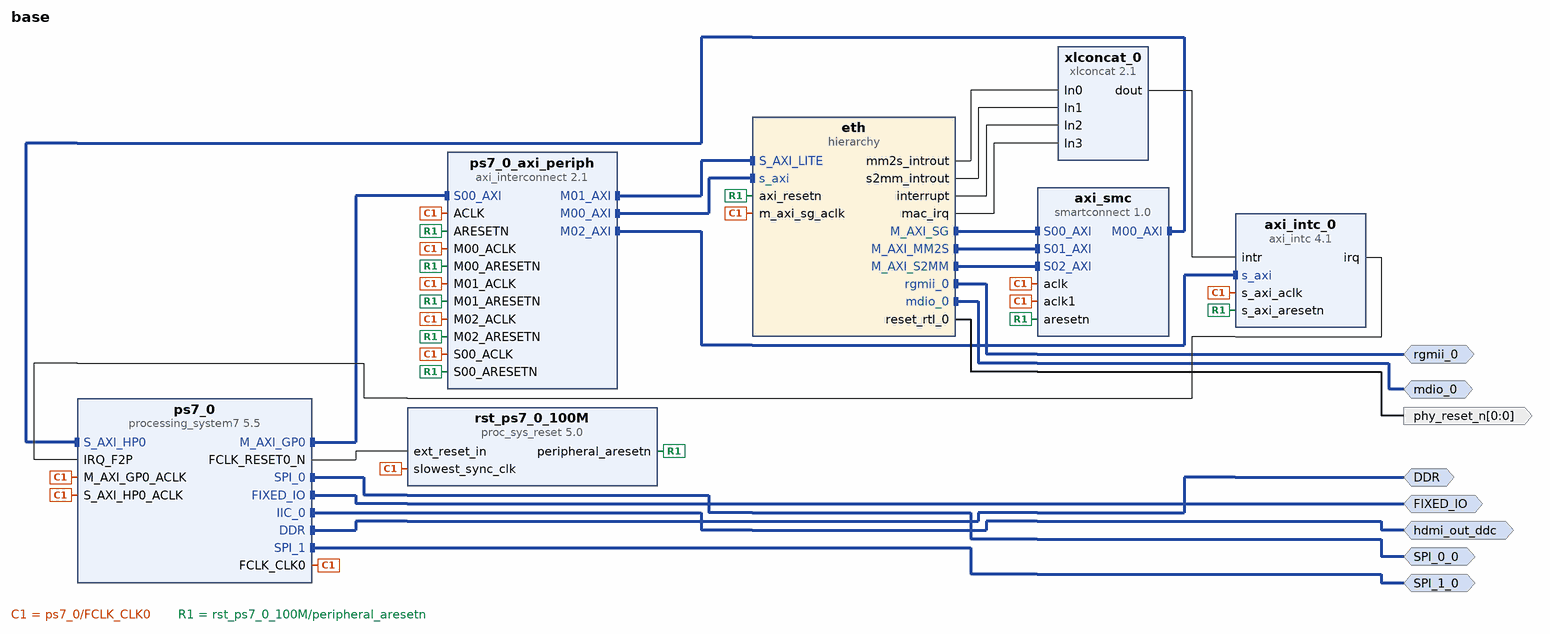
[diagram p0: block diagram of the top level]
# Vivado block design base, xc7z020clg400-1, Vivado 2018.3
create_bd_design base

create_bd_intf_port -mode Master -vlnv xilinx.com:interface:ddrx_rtl:1.0 DDR
create_bd_intf_port -mode Master -vlnv xilinx.com:display_processing_system7:fixedio_rtl:1.0 FIXED_IO
create_bd_intf_port -mode Master -vlnv xilinx.com:interface:iic_rtl:1.0 hdmi_out_ddc
create_bd_intf_port -mode Master -vlnv xilinx.com:interface:mdio_rtl:1.0 mdio_0
create_bd_intf_port -mode Master -vlnv xilinx.com:interface:rgmii_rtl:1.0 rgmii_0
create_bd_intf_port -mode Master -vlnv xilinx.com:interface:spi_rtl:1.0 SPI_0_0
create_bd_intf_port -mode Master -vlnv xilinx.com:interface:spi_rtl:1.0 SPI_1_0
create_bd_port -dir O -from 0 -to 0 -type rst phy_reset_n
set_property -dict {CONFIG.POLARITY ACTIVE_LOW} [get_bd_ports phy_reset_n]

create_bd_cell -type ip -vlnv xilinx.com:ip:processing_system7:5.5 ps7_0
set_property -dict [list \
  CONFIG.PCW_APU_PERIPHERAL_FREQMHZ 650 \
  CONFIG.PCW_CRYSTAL_PERIPHERAL_FREQMHZ 50 \
  CONFIG.PCW_ENET0_ENET0_IO {MIO 16 .. 27} \
  CONFIG.PCW_ENET0_GRP_MDIO_ENABLE 1 \
  CONFIG.PCW_ENET0_GRP_MDIO_IO {MIO 52 .. 53} \
  CONFIG.PCW_ENET0_PERIPHERAL_ENABLE 1 \
  CONFIG.PCW_FPGA0_PERIPHERAL_FREQMHZ 100 \
  CONFIG.PCW_FPGA1_PERIPHERAL_FREQMHZ 142 \
  CONFIG.PCW_FPGA2_PERIPHERAL_FREQMHZ 200 \
  CONFIG.PCW_FPGA3_PERIPHERAL_FREQMHZ 100 \
  CONFIG.PCW_GPIO_EMIO_GPIO_ENABLE 1 \
  CONFIG.PCW_GPIO_EMIO_GPIO_IO 7 \
  CONFIG.PCW_GPIO_EMIO_GPIO_WIDTH 7 \
  CONFIG.PCW_GPIO_MIO_GPIO_ENABLE 0 \
  CONFIG.PCW_I2C0_I2C0_IO EMIO \
  CONFIG.PCW_I2C0_PERIPHERAL_ENABLE 1 \
  CONFIG.PCW_I2C_PERIPHERAL_FREQMHZ 108.333336 \
  CONFIG.PCW_IRQ_F2P_INTR 1 \
  CONFIG.PCW_PERIPHERAL_BOARD_PRESET None \
  CONFIG.PCW_PRESET_BANK1_VOLTAGE {LVCMOS 1.8V} \
  CONFIG.PCW_QSPI_GRP_FBCLK_ENABLE 1 \
  CONFIG.PCW_QSPI_GRP_FBCLK_IO {MIO 8} \
  CONFIG.PCW_QSPI_GRP_SINGLE_SS_ENABLE 1 \
  CONFIG.PCW_QSPI_GRP_SINGLE_SS_IO {MIO 1 .. 6} \
  CONFIG.PCW_QSPI_PERIPHERAL_ENABLE 1 \
  CONFIG.PCW_QSPI_QSPI_IO {MIO 1 .. 6} \
  CONFIG.PCW_SD0_GRP_CD_ENABLE 1 \
  CONFIG.PCW_SD0_GRP_CD_IO {MIO 47} \
  CONFIG.PCW_SD0_GRP_WP_ENABLE 0 \
  CONFIG.PCW_SD0_PERIPHERAL_ENABLE 1 \
  CONFIG.PCW_SD0_SD0_IO {MIO 40 .. 45} \
  CONFIG.PCW_SDIO_PERIPHERAL_FREQMHZ 50 \
  CONFIG.PCW_SINGLE_QSPI_DATA_MODE x4 \
  CONFIG.PCW_SPI0_PERIPHERAL_ENABLE 1 \
  CONFIG.PCW_SPI0_SPI0_IO EMIO \
  CONFIG.PCW_SPI1_PERIPHERAL_ENABLE 1 \
  CONFIG.PCW_SPI1_SPI1_IO EMIO \
  CONFIG.PCW_UART0_PERIPHERAL_ENABLE 1 \
  CONFIG.PCW_UART0_UART0_IO {MIO 14 .. 15} \
  CONFIG.PCW_UART1_PERIPHERAL_ENABLE 0 \
  CONFIG.PCW_UART_PERIPHERAL_FREQMHZ 100 \
  CONFIG.PCW_UIPARAM_DDR_BUS_WIDTH {16 Bit} \
  CONFIG.PCW_UIPARAM_DDR_FREQ_MHZ 525 \
  CONFIG.PCW_UIPARAM_DDR_PARTNO Custom \
  CONFIG.PCW_USB0_PERIPHERAL_ENABLE 1 \
  CONFIG.PCW_USB0_USB0_IO {MIO 28 .. 39} \
  CONFIG.PCW_USE_FABRIC_INTERRUPT 1 \
  CONFIG.PCW_USE_S_AXI_HP0 1 \
] [get_bd_cells ps7_0]
# 484 more settings of ps7_0 are not shown: defaults, MIO pin electricals, DDR timing, and values the tool derives
create_bd_cell -type ip -vlnv xilinx.com:ip:smartconnect:1.0 axi_smc
set_property -dict {CONFIG.NUM_CLKS 2 CONFIG.NUM_SI 3} [get_bd_cells axi_smc]
create_bd_cell -type ip -vlnv xilinx.com:ip:proc_sys_reset:5.0 rst_ps7_0_100M
create_bd_cell -type ip -vlnv xilinx.com:ip:axi_interconnect:2.1 ps7_0_axi_periph
set_property -dict {CONFIG.NUM_MI 3} [get_bd_cells ps7_0_axi_periph]
create_bd_cell -type ip -vlnv xilinx.com:ip:axi_intc:4.1 axi_intc_0
set_property -dict {CONFIG.C_IRQ_CONNECTION 1} [get_bd_cells axi_intc_0]
create_bd_cell -type ip -vlnv xilinx.com:ip:xlconcat:2.1 xlconcat_0
set_property -dict {CONFIG.NUM_PORTS 4} [get_bd_cells xlconcat_0]
create_bd_cell -type hier eth

# ---- hierarchy /eth ----
current_bd_instance /eth
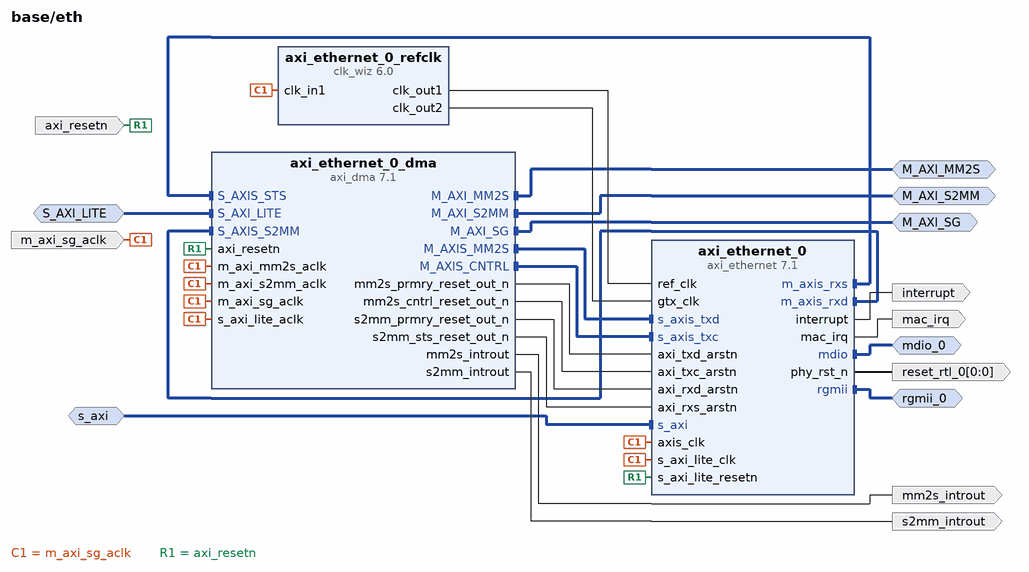
[diagram p1: block diagram inside /eth]
create_bd_intf_pin -mode Slave -vlnv xilinx.com:interface:aximm_rtl:1.0 s_axi
create_bd_intf_pin -mode Master -vlnv xilinx.com:interface:mdio_rtl:1.0 mdio_0
create_bd_intf_pin -mode Master -vlnv xilinx.com:interface:rgmii_rtl:1.0 rgmii_0
create_bd_intf_pin -mode Slave -vlnv xilinx.com:interface:aximm_rtl:1.0 S_AXI_LITE
create_bd_intf_pin -mode Master -vlnv xilinx.com:interface:aximm_rtl:1.0 M_AXI_SG
create_bd_intf_pin -mode Master -vlnv xilinx.com:interface:aximm_rtl:1.0 M_AXI_MM2S
create_bd_intf_pin -mode Master -vlnv xilinx.com:interface:aximm_rtl:1.0 M_AXI_S2MM
create_bd_pin -dir I -type clk m_axi_sg_aclk
create_bd_pin -dir I -type rst axi_resetn
create_bd_pin -dir O -type intr interrupt
create_bd_pin -dir O -from 0 -to 0 -type rst reset_rtl_0
create_bd_pin -dir O -type intr mm2s_introut
create_bd_pin -dir O -type intr s2mm_introut
create_bd_pin -dir O -type intr mac_irq

create_bd_cell -type ip -vlnv xilinx.com:ip:clk_wiz:6.0 axi_ethernet_0_refclk
set_property -dict [list \
  CONFIG.CLKOUT1_REQUESTED_OUT_FREQ 200 \
  CONFIG.CLKOUT2_REQUESTED_OUT_FREQ 125 \
  CONFIG.CLKOUT2_USED true \
  CONFIG.PRIM_SOURCE Single_ended_clock_capable_pin \
  CONFIG.USE_RESET false \
] [get_bd_cells axi_ethernet_0_refclk]
create_bd_cell -type ip -vlnv xilinx.com:ip:axi_ethernet:7.1 axi_ethernet_0
set_property -dict [list \
  CONFIG.PHY_TYPE RGMII \
  CONFIG.RXCSUM None \
  CONFIG.RXMEM 8k \
  CONFIG.RXVLAN_STRP true \
  CONFIG.RXVLAN_TAG true \
  CONFIG.RXVLAN_TRAN true \
  CONFIG.TXCSUM None \
  CONFIG.TXMEM 8k \
  CONFIG.TXVLAN_STRP true \
  CONFIG.TXVLAN_TAG true \
  CONFIG.TXVLAN_TRAN true \
] [get_bd_cells axi_ethernet_0]
create_bd_cell -type ip -vlnv xilinx.com:ip:axi_dma:7.1 axi_ethernet_0_dma
set_property -dict [list \
  CONFIG.c_include_mm2s_dre 1 \
  CONFIG.c_include_s2mm_dre 1 \
  CONFIG.c_sg_length_width 16 \
  CONFIG.c_sg_use_stsapp_length 1 \
] [get_bd_cells axi_ethernet_0_dma]

# ---- connections ----

current_bd_instance /eth
connect_bd_intf_net [get_bd_intf_pins axi_ethernet_0_dma/M_AXIS_MM2S] [get_bd_intf_pins axi_ethernet_0/s_axis_txd]
connect_bd_intf_net [get_bd_intf_pins axi_ethernet_0_dma/M_AXIS_CNTRL] [get_bd_intf_pins axi_ethernet_0/s_axis_txc]
connect_bd_intf_net [get_bd_intf_pins M_AXI_MM2S] [get_bd_intf_pins axi_ethernet_0_dma/M_AXI_MM2S]
connect_bd_intf_net [get_bd_intf_pins M_AXI_S2MM] [get_bd_intf_pins axi_ethernet_0_dma/M_AXI_S2MM]
connect_bd_intf_net [get_bd_intf_pins S_AXI_LITE] [get_bd_intf_pins axi_ethernet_0_dma/S_AXI_LITE]
connect_bd_intf_net [get_bd_intf_pins mdio_0] [get_bd_intf_pins axi_ethernet_0/mdio]
connect_bd_intf_net [get_bd_intf_pins axi_ethernet_0_dma/S_AXIS_STS] [get_bd_intf_pins axi_ethernet_0/m_axis_rxs]
connect_bd_intf_net [get_bd_intf_pins axi_ethernet_0_dma/S_AXIS_S2MM] [get_bd_intf_pins axi_ethernet_0/m_axis_rxd]
connect_bd_intf_net [get_bd_intf_pins s_axi] [get_bd_intf_pins axi_ethernet_0/s_axi]
connect_bd_intf_net [get_bd_intf_pins rgmii_0] [get_bd_intf_pins axi_ethernet_0/rgmii]
connect_bd_intf_net [get_bd_intf_pins M_AXI_SG] [get_bd_intf_pins axi_ethernet_0_dma/M_AXI_SG]
connect_bd_net [get_bd_pins axi_ethernet_0_refclk/clk_out1] [get_bd_pins axi_ethernet_0/ref_clk]
connect_bd_net [get_bd_pins axi_ethernet_0_refclk/clk_out2] [get_bd_pins axi_ethernet_0/gtx_clk]
connect_bd_net [get_bd_pins axi_ethernet_0_dma/mm2s_prmry_reset_out_n] [get_bd_pins axi_ethernet_0/axi_txd_arstn]
connect_bd_net [get_bd_pins axi_ethernet_0_dma/mm2s_cntrl_reset_out_n] [get_bd_pins axi_ethernet_0/axi_txc_arstn]
connect_bd_net [get_bd_pins axi_ethernet_0_dma/s2mm_prmry_reset_out_n] [get_bd_pins axi_ethernet_0/axi_rxd_arstn]
connect_bd_net [get_bd_pins axi_ethernet_0_dma/s2mm_sts_reset_out_n] [get_bd_pins axi_ethernet_0/axi_rxs_arstn]
connect_bd_net -net ps7_0_FCLK_CLK0 [get_bd_pins m_axi_sg_aclk] \
  [get_bd_pins axi_ethernet_0_dma/m_axi_sg_aclk] [get_bd_pins axi_ethernet_0/s_axi_lite_clk] \
  [get_bd_pins axi_ethernet_0_dma/m_axi_mm2s_aclk] [get_bd_pins axi_ethernet_0_dma/m_axi_s2mm_aclk] \
  [get_bd_pins axi_ethernet_0/axis_clk] [get_bd_pins axi_ethernet_0_dma/s_axi_lite_aclk] \
  [get_bd_pins axi_ethernet_0_refclk/clk_in1]
connect_bd_net -net rst_ps7_0_100M_peripheral_aresetn [get_bd_pins axi_resetn] \
  [get_bd_pins axi_ethernet_0_dma/axi_resetn] [get_bd_pins axi_ethernet_0/s_axi_lite_resetn]
connect_bd_net [get_bd_pins axi_ethernet_0/interrupt] [get_bd_pins interrupt]
connect_bd_net [get_bd_pins axi_ethernet_0/phy_rst_n] [get_bd_pins reset_rtl_0]
connect_bd_net [get_bd_pins axi_ethernet_0_dma/mm2s_introut] [get_bd_pins mm2s_introut]
connect_bd_net [get_bd_pins axi_ethernet_0_dma/s2mm_introut] [get_bd_pins s2mm_introut]
connect_bd_net [get_bd_pins axi_ethernet_0/mac_irq] [get_bd_pins mac_irq]

current_bd_instance /
connect_bd_intf_net [get_bd_intf_pins ps7_0/M_AXI_GP0] [get_bd_intf_pins ps7_0_axi_periph/S00_AXI]
connect_bd_intf_net [get_bd_intf_pins ps7_0_axi_periph/M01_AXI] [get_bd_intf_pins eth/S_AXI_LITE]
connect_bd_intf_net [get_bd_intf_pins axi_smc/M00_AXI] [get_bd_intf_pins ps7_0/S_AXI_HP0]
connect_bd_intf_net -intf_net axi_ethernet_0_dma_M_AXI_SG [get_bd_intf_pins eth/M_AXI_SG] [get_bd_intf_pins axi_smc/S00_AXI]
connect_bd_intf_net -intf_net axi_ethernet_0_rgmii [get_bd_intf_ports rgmii_0] [get_bd_intf_pins eth/rgmii_0]
connect_bd_intf_net -intf_net axi_ethernet_0_dma_M_AXI_MM2S [get_bd_intf_pins eth/M_AXI_MM2S] [get_bd_intf_pins axi_smc/S01_AXI]
connect_bd_intf_net [get_bd_intf_ports SPI_0_0] [get_bd_intf_pins ps7_0/SPI_0]
connect_bd_intf_net [get_bd_intf_ports FIXED_IO] [get_bd_intf_pins ps7_0/FIXED_IO]
connect_bd_intf_net [get_bd_intf_pins ps7_0_axi_periph/M02_AXI] [get_bd_intf_pins axi_intc_0/s_axi]
connect_bd_intf_net [get_bd_intf_ports hdmi_out_ddc] [get_bd_intf_pins ps7_0/IIC_0]
connect_bd_intf_net [get_bd_intf_pins ps7_0_axi_periph/M00_AXI] [get_bd_intf_pins eth/s_axi]
connect_bd_intf_net [get_bd_intf_ports DDR] [get_bd_intf_pins ps7_0/DDR]
connect_bd_intf_net -intf_net axi_ethernet_0_dma_M_AXI_S2MM [get_bd_intf_pins eth/M_AXI_S2MM] [get_bd_intf_pins axi_smc/S02_AXI]
connect_bd_intf_net [get_bd_intf_ports SPI_1_0] [get_bd_intf_pins ps7_0/SPI_1]
connect_bd_intf_net -intf_net axi_ethernet_0_mdio [get_bd_intf_ports mdio_0] [get_bd_intf_pins eth/mdio_0]
connect_bd_net -net axi_ethernet_0_phy_rst_n [get_bd_pins eth/reset_rtl_0] [get_bd_ports phy_reset_n]
connect_bd_net [get_bd_pins ps7_0/FCLK_CLK0] \
  [get_bd_pins axi_smc/aclk] [get_bd_pins rst_ps7_0_100M/slowest_sync_clk] [get_bd_pins ps7_0/M_AXI_GP0_ACLK] \
  [get_bd_pins ps7_0_axi_periph/S00_ACLK] [get_bd_pins ps7_0_axi_periph/M00_ACLK] [get_bd_pins ps7_0_axi_periph/ACLK] \
  [get_bd_pins ps7_0_axi_periph/M01_ACLK] [get_bd_pins ps7_0/S_AXI_HP0_ACLK] [get_bd_pins axi_smc/aclk1] \
  [get_bd_pins axi_intc_0/s_axi_aclk] [get_bd_pins ps7_0_axi_periph/M02_ACLK] [get_bd_pins eth/m_axi_sg_aclk]
connect_bd_net [get_bd_pins ps7_0/FCLK_RESET0_N] [get_bd_pins rst_ps7_0_100M/ext_reset_in]
connect_bd_net [get_bd_pins rst_ps7_0_100M/peripheral_aresetn] \
  [get_bd_pins axi_smc/aresetn] [get_bd_pins ps7_0_axi_periph/S00_ARESETN] [get_bd_pins ps7_0_axi_periph/M00_ARESETN] \
  [get_bd_pins ps7_0_axi_periph/ARESETN] [get_bd_pins ps7_0_axi_periph/M01_ARESETN] [get_bd_pins axi_intc_0/s_axi_aresetn] \
  [get_bd_pins ps7_0_axi_periph/M02_ARESETN] [get_bd_pins eth/axi_resetn]
connect_bd_net [get_bd_pins axi_intc_0/irq] [get_bd_pins ps7_0/IRQ_F2P]
connect_bd_net -net axi_ethernet_0_dma_mm2s_introut [get_bd_pins eth/mm2s_introut] [get_bd_pins xlconcat_0/In0]
connect_bd_net -net axi_ethernet_0_dma_s2mm_introut [get_bd_pins eth/s2mm_introut] [get_bd_pins xlconcat_0/In1]
connect_bd_net -net axi_ethernet_0_interrupt [get_bd_pins eth/interrupt] [get_bd_pins xlconcat_0/In2]
connect_bd_net [get_bd_pins xlconcat_0/dout] [get_bd_pins axi_intc_0/intr]
connect_bd_net [get_bd_pins eth/mac_irq] [get_bd_pins xlconcat_0/In3]
set_property HDL_ATTRIBUTE.BMM_INFO_PROCESSOR {arm > base iop_pmoda/mb_bram_ctrl base iop_pmodb/mb_bram_ctrl base iop_arduino/mb_bram_ctrl} [get_bd_cells ps7_0]
set_property HDL_ATTRIBUTE.KEEP_HIERARCHY yes [get_bd_cells ps7_0]

# ---- address map ----
assign_bd_address -offset 0x00000000 -range 512M -target_address_space [get_bd_addr_spaces eth/axi_ethernet_0_dma/Data_MM2S] [get_bd_addr_segs ps7_0/S_AXI_HP0/HP0_DDR_LOWOCM]
assign_bd_address -offset 0x00000000 -range 512M -target_address_space [get_bd_addr_spaces eth/axi_ethernet_0_dma/Data_S2MM] [get_bd_addr_segs ps7_0/S_AXI_HP0/HP0_DDR_LOWOCM]
assign_bd_address -offset 0x00000000 -range 512M -target_address_space [get_bd_addr_spaces eth/axi_ethernet_0_dma/Data_SG] [get_bd_addr_segs ps7_0/S_AXI_HP0/HP0_DDR_LOWOCM]
assign_bd_address -offset 0x40000000 -range 64K -target_address_space [get_bd_addr_spaces ps7_0/Data] [get_bd_addr_segs axi_intc_0/S_AXI/Reg]
assign_bd_address -offset 0x40800000 -range 64K -target_address_space [get_bd_addr_spaces ps7_0/Data] [get_bd_addr_segs eth/axi_ethernet_0_dma/S_AXI_LITE/Reg]
assign_bd_address -offset 0x41000000 -range 64K -target_address_space [get_bd_addr_spaces ps7_0/Data] [get_bd_addr_segs eth/axi_ethernet_0/s_axi/Reg0]

validate_bd_design
save_bd_design
